# EAGLE design nRF24L01HBridge (EAGLE 6.4)
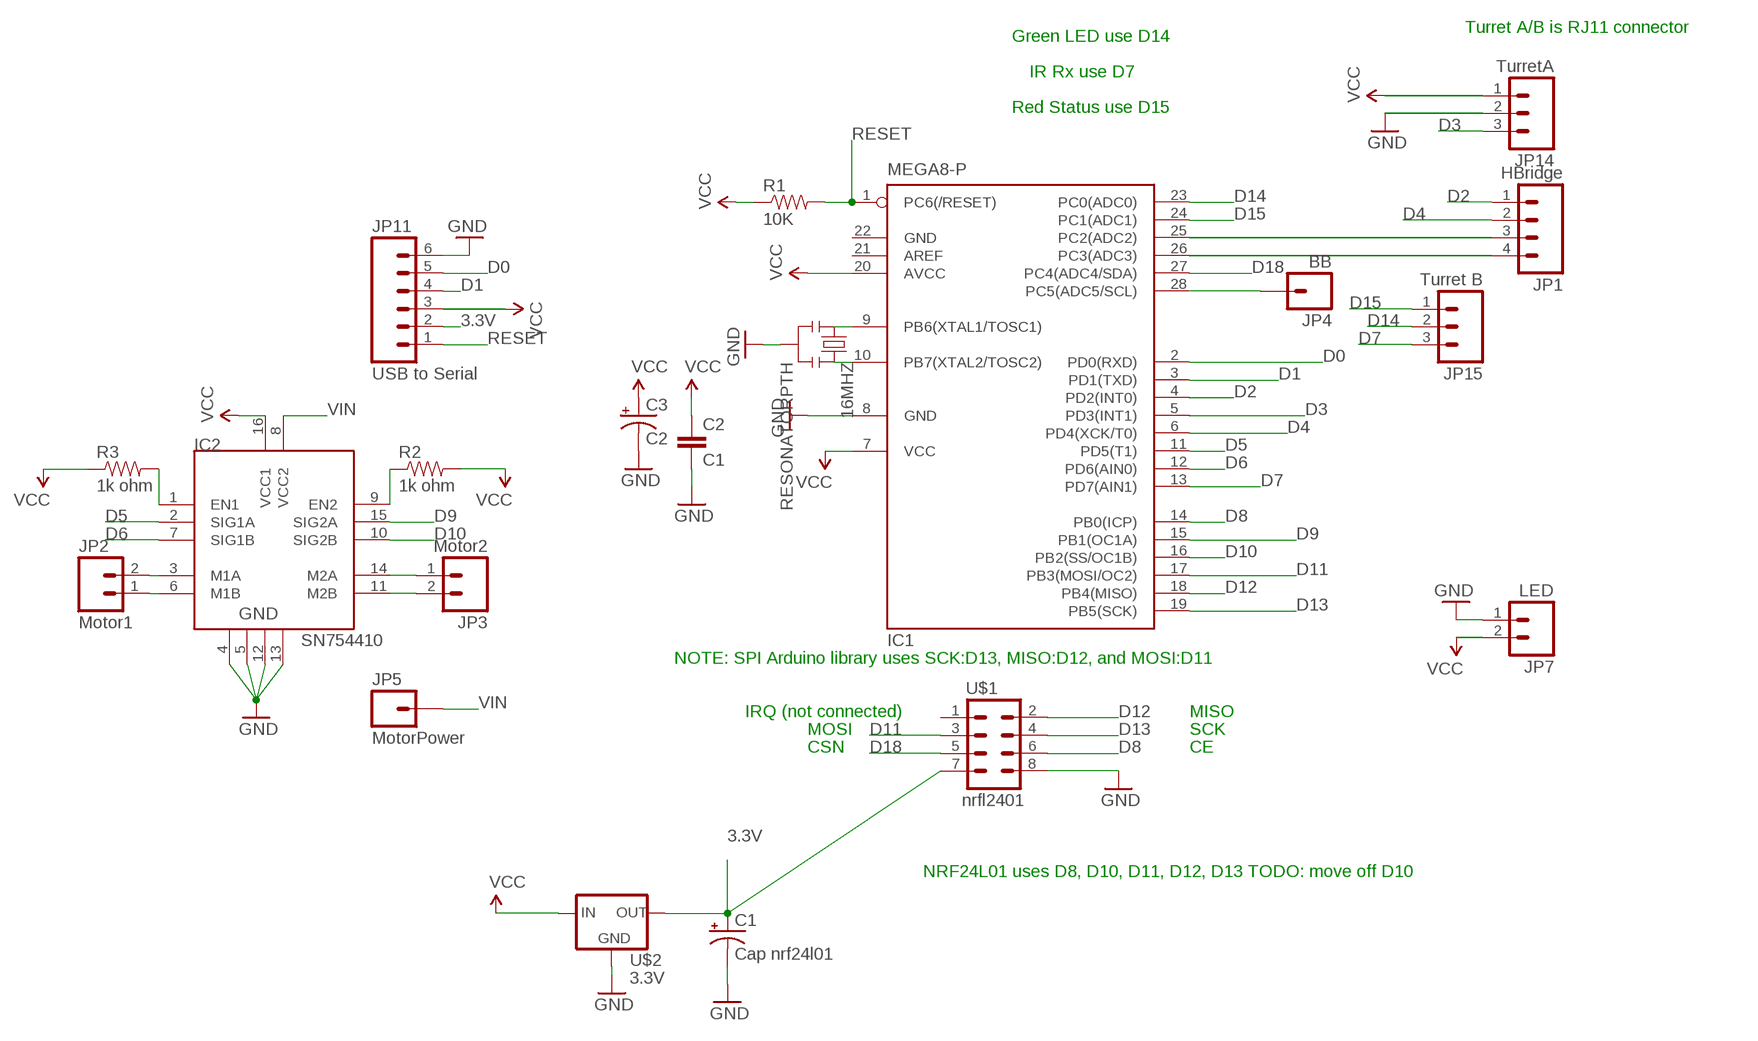
[diagram p0: schematic, sheet 1]

## Parts
16MHZ  RESONATORPTH  [RESONATOR-PTH]
C1  Cap nrf24l01  CAP_POLPTH2  [CPOL-RADIAL-10UF-25V]
C2  C1  CAPPTH  [CAP-PTH-SMALL]
C3  C2  CAP_POLPTH1  [CPOL-RADIAL-100UF-25V]
IC1  MEGA8-P  [DIL28-3]
IC2  SN754410  [DIP16]
JP1  HBridge  M04PTH  [1X04]
JP2  Motor1  M02LOCK  [1X02_LOCK]
JP3  Motor2  M02LOCK  [1X02_LOCK]
JP4  BB  M01PTH  [1X01]
JP5  MotorPower  M01PTH  [1X01]
JP7  LED  M02PTH  [1X02]
JP11  USB to Serial  M06SIP  [1X06]
JP14  TurretA  M03PTH  [1X03]
JP15  Turret B  M03PTH  [1X03]
R1  10K  RESISTORPTH1  [AXIAL-0.3]
R2  1k ohm  RESISTORPTH1  [AXIAL-0.3]
R3  1k ohm  RESISTORPTH1  [AXIAL-0.3]
U$1  nrfl2401  M04X2  [2X4]
U$2  3.3V  V_REG_LD1117VXX  [78XXL]

## Nets
3.3V: C1.1(+) JP11.2 U$1.7 U$2.GND(OUT)
D0: IC1.2(PD0(RXD)) JP11.5
D1: IC1.3(PD1(TXD)) JP11.4
D2: IC1.4(PD2(INT0)) JP1.1
D3: IC1.5(PD3(INT1)) JP14.3
D4: IC1.6(PD4(XCK/T0)) JP1.2
D5: IC1.11(PD5(T1)) IC2.2(SIG1A)
D6: IC1.12(PD6(AIN0)) IC2.7(SIG1B)
D7: IC1.13(PD7(AIN1)) JP15.3
D8: IC1.14(PB0(ICP)) U$1.6
D9: IC1.15(PB1(OC1A)) IC2.15(SIG2A)
D10: IC1.16(PB2(SS/OC1B)) IC2.10(SIG2B)
D11: IC1.17(PB3(MOSI/OC2)) U$1.3
D12: IC1.18(PB4(MISO)) U$1.2
D13: IC1.19(PB5(SCK)) U$1.4
D14: IC1.23(PC0(ADC0)) JP15.2
D15: IC1.24(PC1(ADC1)) JP15.1
D18: IC1.27(PC4(ADC4/SDA)) U$1.5
GND: 16MHZ.2 C1.2(-) C2.2 C3.2(-) IC1.8(GND) IC2.4 IC2.5 IC2.12 IC2.13 JP7.1 JP11.6 JP14.2 U$1.8 U$2.IN(GND)
N$1: 16MHZ.3 IC1.10(PB7(XTAL2/TOSC2))
N$2: 16MHZ.1 IC1.9(PB6(XTAL1/TOSC1))
N$3: IC2.9(EN2) R2.P$1
N$4: IC2.1(EN1) R3.P$2
N$5: IC2.6(M1B) JP2.1
N$6: IC2.3(M1A) JP2.2
N$7: IC2.14(M2A) JP3.1
N$8: IC2.11(M2B) JP3.2
N$17: IC1.25(PC2(ADC2)) JP1.3
N$18: IC1.26(PC3(ADC3)) JP1.4
N$21: IC1.28(PC5(ADC5/SCL)) JP4.1
RESET: IC1.1(PC6(/RESET)) JP11.1 R1.P$2
VCC: C2.1 C3.1(+) IC1.7(VCC) IC1.20(AVCC) IC2.16(VCC1) JP7.2 JP11.3 JP14.1 R1.P$1 R2.P$2 R3.P$1 U$2.OUT(IN)
VIN: IC2.8(VCC2) JP5.1
Unconnected: IC1.21(AREF) U$1.1

## Notes on the sheet
- Turret A/B is RJ11 connector
- Green LED use D14
- IR Rx use D7
- Red Status use D15
- NOTE: SPI Arduino library uses SCK:D13, MISO:D12, and MOSI:D11
- IRQ (not connected) | MISO
- MOSI | SCK
- CSN | CE
- NRF24L01 uses D8, D10, D11, D12, D13 TODO: move off D10

## Power pins joined to a net without a drawn wire
GND: IC1.22(GND)

## Library data of the parts
16MHZ = SparkFun:RESONATOR: Resonator Small SMD resonator. This is the itty bitty 10/20MHz resonators with built in caps. CSTCE10M0G55 and CSTCE20M0V53. Footprint has been reviewed closely but hasn't been tested yet.
C1 C3 = SparkFun:CAP_POL: Capacitor Polarized These are standard SMD and PTH capacitors. Normally 10uF, 47uF, and 100uF in electrolytic and tantalum varieties. Always verify the external diameter of the through hole cap, it varies with capacity, voltage, and manufacturer. The EIA devices should be standard.
C2 = SparkFun:CAP: Capacitor Standard 0603 ceramic capacitor, and 0.1" leaded capacitor.
IC1 = atmel:MEGA8-P: MICROCONTROLLER 8 Kbytes FLASH, 1 kbytes SRAM, 512 bytes EEPROM, USART, 4-channel 10 bit ADC, 2-channel 8 bit ADC Pin compatible with Atmega48, ATMega88, ATMega168 Source: avr.lbr; OC_FARNELL: unknown; OC_NEWARK: unknown
IC2 = HBridge:SN754410: Quadruple half-H driver
JP1 = SparkFun:M04: Header 4 Standard 4-pin 0.1" header. Use with straight break away headers (SKU : PRT-00116), right angle break away headers (PRT-00553), swiss pins (PRT-00743), machine pins (PRT-00117), and female headers (PRT-00115). Molex polarized connector foot print use with SKU : PRT-08231 with associated crimp pins and housings.
JP2 JP3 = SparkFun-Connectors:M02: Header 2 Standard 2-pin 0.1" header. Use with straight break away headers (SKU : PRT-00116), right angle break away headers (PRT-00553), swiss pins (PRT-00743), machine pins (PRT-00117), and female headers (PRT-00115). Molex polarized connector foot print use with SKU : PRT-08233 with associated crimp pins and housings.
JP4 = SparkFun:M01: Header 1 Standard 1-pin 0.1" header. Use with straight break away headers (SKU : PRT-00116), right angle break away headers (PRT-00553), swiss pins (PRT-00743), machine pins (PRT-00117), and female headers (PRT-00115).
JP5 = SparkFun-Connectors:M01: Header 1 Standard 1-pin 0.1" header. Use with straight break away headers (SKU : PRT-00116), right angle break away headers (PRT-00553), swiss pins (PRT-00743), machine pins (PRT-00117), and female headers (PRT-00115).
JP7 = SparkFun:M02: Header 2 Standard 2-pin 0.1" header. Use with straight break away headers (SKU : PRT-00116), right angle break away headers (PRT-00553), swiss pins (PRT-00743), machine pins (PRT-00117), and female headers (PRT-00115). Molex polarized connector foot print use with SKU : PRT-08233 with associated crimp pins and housings.
JP11 = SparkFun:M06: Header 6 Standard 6-pin 0.1" header. Use with straight break away headers (SKU : PRT-00116), right angle break away headers (PRT-00553), swiss pins (PRT-00743), machine pins (PRT-00117), and female headers (PRT-00115). Molex polarized connector foot print use with SKU : PRT-08094 with associated crimp pins and housings. NOTES ON THE VARIANTS LOCK and LOCK_LONGPADS... This footprint was designed to help hold the alignment of a through-hole component (i.e. 6-pin header) while soldering it into place. You may notice that each hole has been shifted either up or down by 0.005 of an inch from it's more standard position (which is a perfectly straight line). This slight alteration caused the pins (the squares in the middle) to touch the edges of the holes. Because they are alternating, it causes a "brace" to hold the component in place. 0.005 has proven to be the perfect amount of "off-center" position when using our standard breakaway headers. Although looks a little odd when you look at the bare footprint, once you have a header in there, the alteration is very hard to notice. Also, if you push a header all the way into place, it is covered up entirely on the bottom side. This idea of altering the position of holes to aid alignment will be further integrated into the Sparkfun Library for other footprints. It can help hold any component with 3 or more connection pins.
JP14 JP15 = SparkFun:M03: Header 3 Standard 3-pin 0.1" header. Use with straight break away headers (SKU : PRT-00116), right angle break away headers (PRT-00553), swiss pins (PRT-00743), machine pins (PRT-00117), and female headers (PRT-00115). Molex polarized connector foot print use with SKU : PRT-08232 with associated crimp pins and housings.
R1-R3 = SparkFun:RESISTOR: Resistor Basic schematic elements and footprints for 0603, 1206, and PTH 1/10th watt (small) resistors.
U$1 = SparkFun:M04X2
U$2 = SparkFun:V_REG_LD1117VXX: LD1117VXX voltage regulator. We carry the 3.3V version (COM-00526) in TO-220 package.

## Board
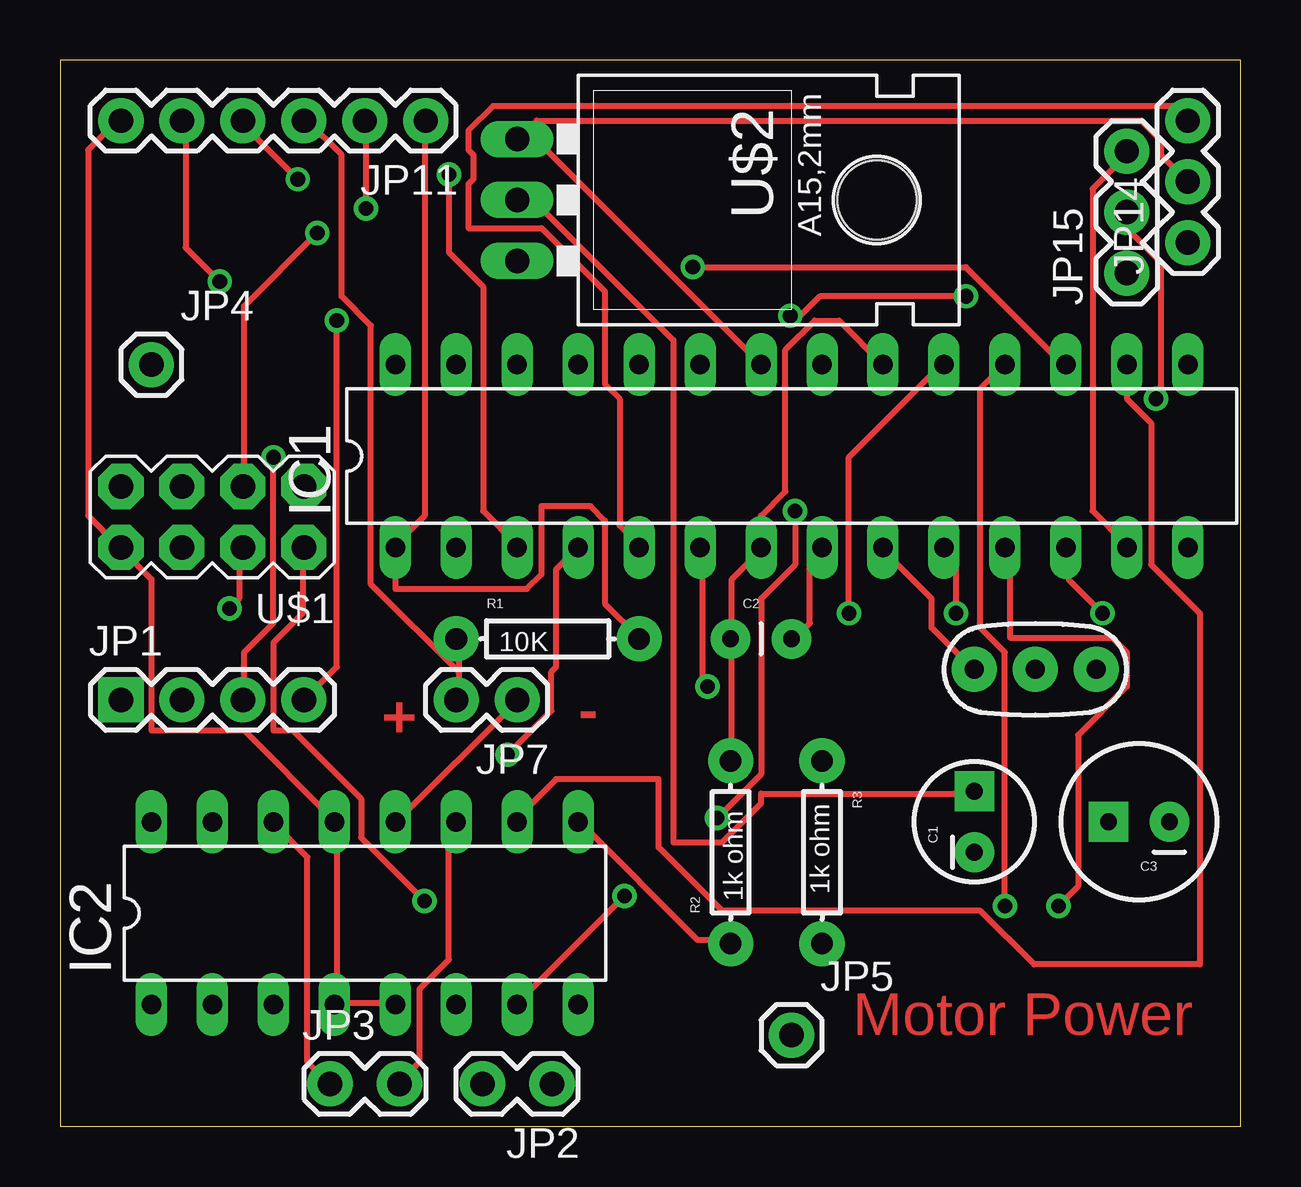
[diagram p1: board, top side]
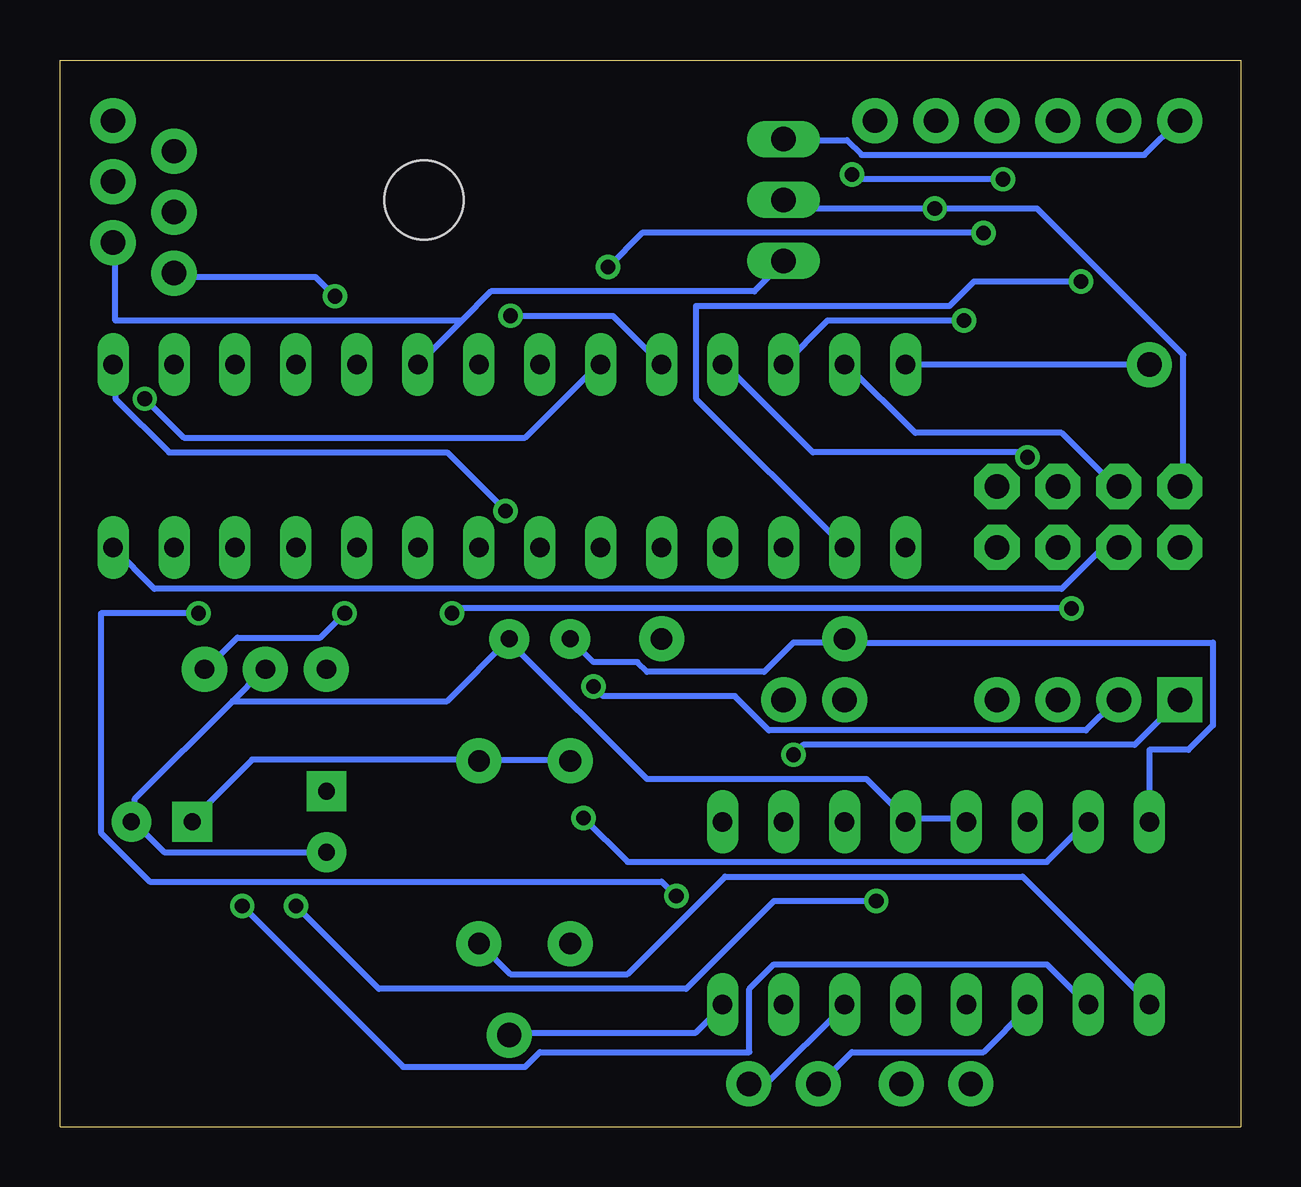
[diagram p2: board, bottom side, seen from below]

Size 49.2 x 44.45 mm. Coordinates in mm from the lower left corner, seen from the top.
Outline: 49.2,0 49.2,44.45 0,44.45 0,0 49.2,0
Copper layers (1*16): Top 0.035mm / dielectric 1.5mm / Bottom 0.035mm
Design rules "default": minimum track width 10mil, minimum drill 24mil, track to track 8mil, track to pad 8mil, pad to pad 8mil, via to via 8mil, smd to smd 8mil, copper to edge 40mil, drill to drill 8mil, minimum pad ring 10mil, minimum via ring 8mil, stop-mask expansion 4mil, vias tented up to drill 0mil, thermal gap 10mil

### Footprints (pad centres in the part's own frame; a part is rotated, then mirrored left to right if it is on the bottom)
RESONATOR-PTH = drill 0.8 pad 1.88: 1 -2.54,0; 2 0,0; 3 2.54,0
CPOL-RADIAL-10UF-25V = drill 0.7 pad 1.651 square: 1 1.27,0 | drill 0.7 pad 1.651: 2 -1.27,0
CAP-PTH-SMALL = drill 0.7 pad 1.651: 1 0,0; 2 2.54,0
CPOL-RADIAL-100UF-25V = drill 0.7 pad 1.651 square: 1 1.27,0 | drill 0.7 pad 1.651: 2 -1.27,0
DIL28-3 = drill 0.813 long: 1 -16.51,-3.81; 2 -13.97,-3.81; 3 -11.43,-3.81; 4 -8.89,-3.81; 5 -6.35,-3.81; 6 -3.81,-3.81; 7 -1.27,-3.81; 8 1.27,-3.81; 9 3.81,-3.81; 10 6.35,-3.81; 11 8.89,-3.81; 12 11.43,-3.81; 13 13.97,-3.81; 14 16.51,-3.81; 15 16.51,3.81; 16 13.97,3.81; 17 11.43,3.81; 18 8.89,3.81; 19 6.35,3.81; 20 3.81,3.81; 21 1.27,3.81; 22 -1.27,3.81; 23 -3.81,3.81; 24 -6.35,3.81; 25 -8.89,3.81; 26 -11.43,3.81; 27 -13.97,3.81; 28 -16.51,3.81
DIP16 = drill 0.813 long: 1 -10.16,-3.81; 2 -7.62,-3.81; 3 -5.08,-3.81; 4 -2.54,-3.81; 5 0,-3.81; 6 2.54,-3.81; 7 5.08,-3.81; 8 7.62,-3.81; 9 7.62,3.81; 10 5.08,3.81; 11 2.54,3.81; 12 0,3.81; 13 -2.54,3.81; 14 -5.08,3.81; 15 -7.62,3.81; 16 -10.16,3.81
1X04 = drill 1.016 pad 1.88 square: 1 0,0 | drill 1.016 pad 1.88: 2 2.54,0; 3 5.08,0; 4 7.62,0
1X02_LOCK = drill 1.016 pad 1.88: 1 -0.178,0; 2 2.718,0
1X01 = drill 1.016 pad 1.88: 1 0,0
1X02 = drill 1.016 pad 1.88: 1 0,0; 2 2.54,0
1X06 = drill 1.016 pad 1.88: 1 0,0; 2 2.54,0; 3 5.08,0; 4 7.62,0; 5 10.16,0; 6 12.7,0
1X03 = drill 1.016 pad 1.88: 1 0,0; 2 2.54,0; 3 5.08,0
AXIAL-0.3 = drill 0.9 pad 1.88: P$1 -3.81,0; P$2 3.81,0
2X4 = drill 1.016 pad 1.88 octagon: 1 -3.81,-1.27; 2 -3.81,1.27; 3 -1.27,-1.27; 4 -1.27,1.27; 5 1.27,-1.27; 6 1.27,1.27; 7 3.81,-1.27; 8 3.81,1.27
78XXL = drill 1.016 long: GND 0,-3.81; IN -2.54,-3.81; OUT 2.54,-3.81 | hole 3.302: 0,11.176

### Placement (x,y rotation side)
16MHZ  40.64,19.06 0 top
C1  38.1,12.71 90 top
C2  27.94,20.33 0 top
C3  44.96,12.71 180 top
IC1  30.48,27.95 0 top
IC2  13.97,8.9 0 top
JP1  2.54,17.79 0 top
JP2  20.32,1.79 180 top
JP3  11.43,1.79 0 top
JP4  3.81,31.76 0 top
JP5  30.48,3.82 0 top
JP7  19.05,17.79 180 top
JP11  15.24,41.92 180 top
JP14  46.99,36.84 90 top
JP15  44.45,35.57 90 top
R1  20.32,20.33 0 top
R2  27.94,11.44 90 top
R3  31.75,11.44 270 top
U$1  6.35,25.41 180 top
U$2  22.86,38.62 270 top

### Tracks (layer width: path | path; a pad name or v marks a point on that pad's centre or on a via)
3.3V  (via drill 0.61)
  Top 0.254: C1.1 37.95,13.88 29.21,13.88 29.21,13.47 27.58,11.85 25.55,11.85 25.55,32.78 19.86,38.47 19.05,38.47 U$2.GND | v12.75,38.26 12.75,41.92 JP11.2
  Bottom 0.254: U$2.GND 19.05,38.47 18.85,38.26 v12.75,38.26 8.48,38.26 2.39,32.17 2.39,26.68 U$1.7
D0  (via drill 0.61)
  Top 0.254: v6.66,35.21 5.23,36.64 5.23,41.92 JP11.5
  Bottom 0.254: IC1.2 22.71,30.34 22.71,34.2 12.14,34.2 11.12,35.21 v6.66,35.21
D1  (via drill 0.61)
  Top 0.254: v16.2,39.69 16.2,36.43 17.63,35.01 17.63,25.66 19.05,24.24 IC1.3 | v9.91,39.48 7.67,41.72 7.67,41.92 JP11.4
  Bottom 0.254: v16.2,39.69 16,39.48 v9.91,39.48
D2  (via drill 0.61)
  Top 0.254: IC1.4 20.68,23.23 20.68,19.16 20.47,18.96 20.47,17.33 v18.64,15.5
  Bottom 0.254: v18.64,15.5 18.24,15.91 4.42,15.91 JP1.1
D3
  Top 0.254: IC1.5 24.13,24.24 23.32,25.05 23.32,30.34 22.71,30.95 22.71,34.81 20.07,37.45 17.02,37.45 17.02,39.28 17.22,39.48 17.22,40.5 17.02,40.7 17.02,41.51 18.03,42.53 46.89,42.53 46.89,41.92 JP14.3
D4  (via drill 0.61)
  Top 0.254: v26.98,18.35 26.77,18.55 26.77,24.04 IC1.6
  Bottom 0.254: v26.98,18.35 26.57,17.94 21.08,17.94 19.66,16.52 6.45,16.52 5.23,17.74 JP1.2
D5  (via drill 0.61)
  Top 0.254: v41.61,9.21 42.42,10.02 42.42,16.32 44.45,18.35 44.45,19.77 43.84,20.38 39.57,20.38 39.57,23.84 39.37,24.04 IC1.11
  Bottom 0.254: v41.61,9.21 34.9,2.5 29.82,2.5 29.21,3.11 20.47,3.11 20.47,5.75 19.46,6.77 8.08,6.77 6.45,5.14 IC2.2
D6  (via drill 0.61)
  Top 0.254: v23.52,9.61 19.05,5.14 IC2.7 | v43.43,21.4 42.01,22.82 42.01,24.04 IC1.12
  Bottom 0.254: v23.52,9.61 24.13,10.22 45.47,10.22 47.5,12.25 47.5,21.4 v43.43,21.4
D7
  Top 0.254: IC1.13 44.45,24.24 43.03,25.66 43.03,39.08 44.45,40.5 JP15.3
D8
  Bottom 0.254: IC1.14 45.26,22.41 7.47,22.41 5.84,24.04 5.23,24.04 U$1.6
D9  (via drill 0.61)
  Top 0.254: v27.38,12.86 29.21,14.69 29.21,22.01 30.63,23.43 v30.63,25.66
  Bottom 0.254: v27.38,12.86 25.55,11.03 8.08,11.03 6.45,12.66 IC2.15 | v30.63,25.66 33.07,28.1 44.65,28.1 46.89,30.34 46.89,31.76 IC1.15
D10
  Top 0.254: IC1.16 44.45,30.34 45.47,29.32 45.47,23.43 47.5,21.4 47.5,6.77 40.59,6.77 38.35,9 27.58,9 24.94,11.64 24.94,14.49 20.68,14.49 19.05,12.86 IC2.10
D11  (via drill 0.61)
  Top 0.254: v26.36,35.82 37.74,35.82 41.81,31.76 IC1.17 | v10.72,37.25 7.67,34.2 7.67,26.68 U$1.3
  Bottom 0.254: v26.36,35.82 24.94,37.25 v10.72,37.25
D12  (via drill 0.61)
  Top 0.254: IC1.18 38.35,30.74 38.35,20.79 39.37,19.77 v39.37,9.21 | v15.19,9.41 12.55,12.05 12.55,13.68 9.7,16.52 8.89,16.52 8.89,20.18 10.11,21.4 10.11,24.04 U$1.2
  Bottom 0.254: v39.37,9.21 35.92,5.75 23.11,5.75 19.46,9.41 v15.19,9.41
D13  (via drill 0.61)
  Top 0.254: v32.87,21.4 32.87,27.9 36.73,31.76 IC1.19 | v7.06,21.6 7.47,22.01 7.47,24.04 U$1.4
  Bottom 0.254: v32.87,21.4 32.66,21.6 v7.06,21.6
D14  (via drill 0.61)
  Top 0.254: v45.67,30.34 45.87,30.54 45.87,36.03 44.45,37.45 JP15.2
  Bottom 0.254: v45.67,30.34 44.04,28.71 29.82,28.71 26.77,31.76 IC1.23
D15  (via drill 0.61)
  Top 0.254: v30.43,33.79 30.84,33.79 31.65,34.61 v37.74,34.61
  Bottom 0.254: IC1.24 26.16,33.79 v30.43,33.79 | v37.74,34.61 38.56,35.42 44.45,35.42 JP15.1
D18
  Bottom 0.254: IC1.27 16.41,31.76 13.56,28.92 7.47,28.92 5.23,26.68 U$1.5
GND
  Top 0.254: IC1.8 31.24,23.63 31.24,20.99 30.63,20.38 C2.2 | 11.53,5.14 13.97,5.14 IC2.5 | 11.53,5.14 11.53,12.66 IC2.13 11.33,12.86 7.67,16.52 3.81,16.52 3.81,22.82 2.59,24.04 U$1.8 2.39,24.24 1.17,25.46 1.17,40.7 2.39,41.92 JP11.6 | 11.53,5.14 IC2.4 | JP7.1 19.05,17.74 13.97,12.66 IC2.12 | 19.86,41.11 IC1.22 | 19.86,41.11 19.05,41.11 U$2.IN 19.86,41.11 | JP14.2 45.87,40.5 45.87,41.11 45.06,41.92 19.86,41.92 19.86,41.11
  Bottom 0.254: C1.2 44.86,11.44 46.08,12.66 C3.2 46.08,12.86 46.08,13.68 42.01,17.74 | 42.01,17.74 40.79,18.96 16MHZ.2 | 42.01,17.74 33.07,17.74 C2.2 30.43,20.18 24.74,14.49 15.6,14.49 13.97,12.86 | 13.97,12.86 11.53,12.86 IC2.13 | JP11.6 2.59,41.92 4.01,40.5 15.8,40.5 16.41,41.11 19.05,41.11 U$2.IN | 13.97,12.86 IC2.12
N$1  (via drill 0.61)
  Top 0.254: IC1.10 37.34,23.63 v37.34,21.4
  Bottom 0.254: v37.34,21.4 38.35,20.38 41.81,20.38 43.03,19.16 16MHZ.3
N$2
  Top 0.254: IC1.9 34.29,24.04 36.32,22.01 36.32,20.79 37.95,19.16 16MHZ.1
N$3
  Top 0.254: IC2.9 21.69,12.66 26.57,7.78 27.79,7.78 R2.P$1
N$4
  Bottom 0.254: IC2.1 3.81,5.14 9.09,10.42 21.49,10.42 25.55,6.36 30.43,6.36 31.65,7.58 R3.P$2
N$5
  Bottom 0.254: IC2.6 16.61,4.94 19.66,1.89 20.47,1.89 JP2.1
N$6
  Bottom 0.254: IC2.3 8.89,4.94 10.72,3.11 16.2,3.11 17.42,1.89 JP2.2
N$7
  Top 0.254: IC2.14 8.89,12.66 10.31,11.24 10.31,2.7 11.12,1.89 JP3.1
N$8
  Top 0.254: IC2.11 16.41,12.66 16.2,12.46 16.2,6.97 14.99,5.75 14.99,2.7 14.17,1.89 JP3.2
N$17  (via drill 0.61)
  Top 0.254: v8.89,27.9 8.89,20.99 7.67,19.77 7.67,17.94 JP1.3
  Bottom 0.254: v8.89,27.9 9.09,28.1 17.83,28.1 21.49,31.76 IC1.25
N$18  (via drill 0.61)
  Top 0.254: v11.53,33.59 11.53,19.16 JP1.4
  Bottom 0.254: IC1.26 17.22,33.59 v11.53,33.59
N$21
  Bottom 0.254: JP4.1 IC1.28
RESET
  Top 0.254: JP11.1 15.19,41.92 15.19,25.46 13.97,24.24 IC1.1 13.97,22.41 19.46,22.41 20.07,23.02 20.07,25.87 22.1,25.87 22.71,25.26 22.71,21.8 24.13,20.38 R1.P$2
VCC
  Top 0.254: R2.P$2 27.99,15.3 27.99,20.18 C2.1 27.99,20.38 27.99,22.82 29.21,24.04 IC1.7 29.21,25.46 30.23,26.48 30.23,32.37 31.45,33.59 32.46,33.59 IC1.20 | 16.61,18.96 16.61,20.18 R1.P$1 | 16.61,18.96 16.61,17.94 JP7.2 | 16.61,18.96 12.95,22.62 12.95,33.39 11.73,34.61 11.73,40.5 10.31,41.92 JP11.3
  Bottom 0.254: 32.46,33.59 31.24,34.81 20.27,34.81 19.05,36.03 U$2.OUT | 32.46,33.59 IC1.20 | 32.46,33.59 46.89,33.59 46.89,36.84 JP14.1 | C3.1 43.64,12.86 41.2,15.3 31.85,15.3 R3.P$1 31.65,15.3 27.99,15.3 R2.P$2 | IC2.16 3.81,15.71 2.18,15.71 1.17,16.72 1.17,20.18 16.41,20.18 R1.P$1 16.61,20.18 18.64,20.18 19.86,18.96 24.74,18.96 25.15,19.36 26.98,19.36 C2.1
VIN
  Bottom 0.254: IC2.8 21.69,4.94 22.71,3.92 30.43,3.92 JP5.1

### Text on the board
Top: + | - | Motor Power